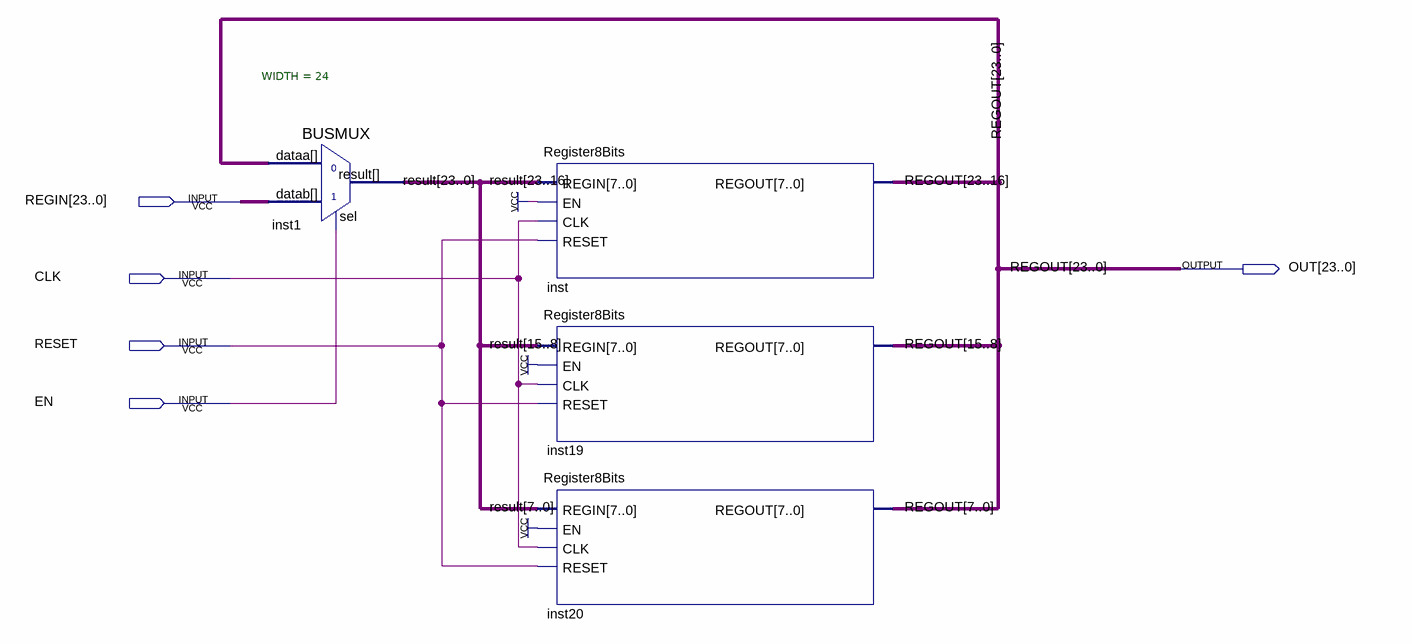
[diagram p0: schematic sheet]
// Quartus schematic Register24Bits.bdf as structural Verilog: 4 symbols, 5 pins
module Register24Bits (
  input  [23:0] REGIN,
  input  CLK,
  input  RESET,
  input  EN,
  output [23:0] OUT
);

  wire [23:0] result;

  BUSMUX #(.WIDTH(24)) inst1 (.datab(REGIN), .sel(EN), .dataa(OUT), .result(result));
  Register8Bits inst (.REGIN(result[23:16]), .EN(1'b1), .CLK(CLK), .RESET(RESET), .REGOUT(OUT[23:16]));
  Register8Bits inst19 (.REGIN(result[15:8]), .EN(1'b1), .CLK(CLK), .RESET(RESET), .REGOUT(OUT[15:8]));
  Register8Bits inst20 (.REGIN(result[7:0]), .EN(1'b1), .CLK(CLK), .RESET(RESET), .REGOUT(OUT[7:0]));

  // Other names for the same wires on the sheet: REGOUT[23:0] = OUT
endmodule
